# Altium schematic sheet MB252.SchDoc
size A4; Revision: B.1(PCB.SCH)
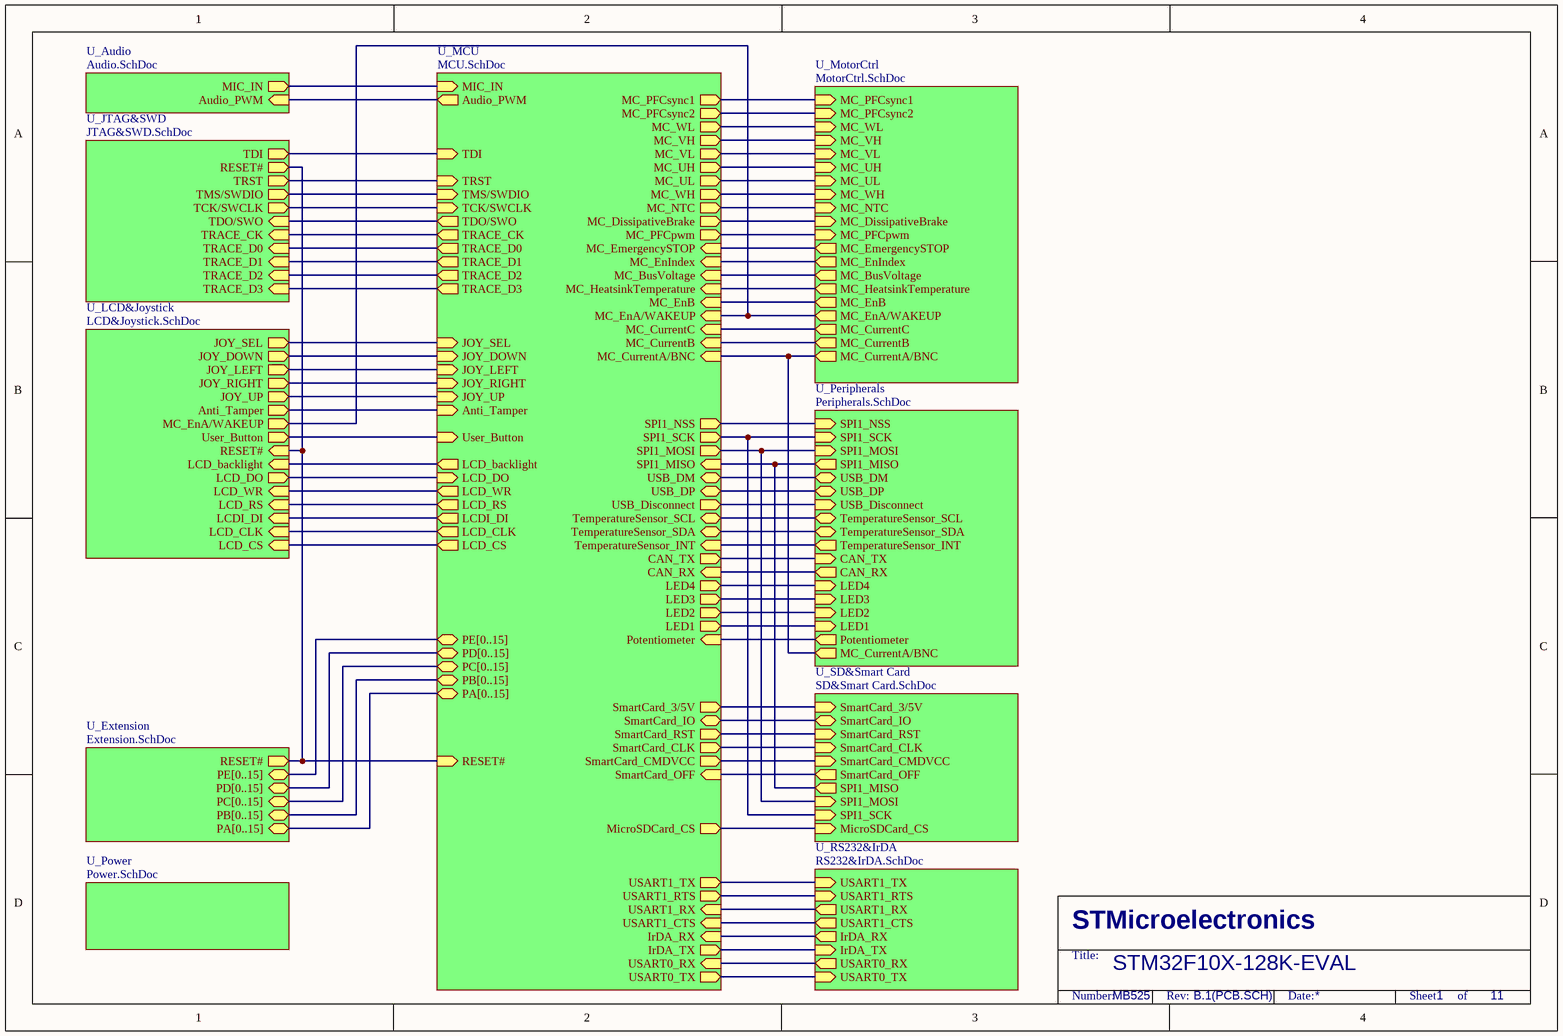
[diagram p0: MB252.SchDoc]

## Sub-sheets
U_Audio = Audio.SchDoc: Audio_PWM (in), MIC_IN (out)
U_Extension = Extension.SchDoc: PA[0..15] (bidir), PB[0..15] (bidir), PC[0..15] (bidir), PD[0..15] (bidir), PE[0..15] (bidir), RESET# (out)
U_JTAG&SWD = JTAG&SWD.SchDoc: TDI (out), RESET# (out), TRACE_D3 (in), TRACE_D2 (in), TRACE_D1 (in), TRACE_D0 (in), TRACE_CK (in), TRST (out), TMS/SWDIO (out), TCK/SWCLK (out), TDO/SWO (in)
U_LCD&Joystick = LCD&Joystick.SchDoc: JOY_SEL (out), JOY_DOWN (out), JOY_LEFT (out), JOY_RIGHT (out), JOY_UP (out), LCD_CS (in), LCD_CLK (in), LCD_DO (out), LCDI_DI (in), LCD_RS (in), LCD_WR (in), RESET# (in), LCD_backlight (in), Anti_Tamper (out), MC_EnA/WAKEUP (out), User_Button (out)
U_MCU = MCU.SchDoc: MC_EnA/WAKEUP (in), MC_EnB (in), JOY_DOWN (in), MC_BusVoltage (in), SPI1_NSS (out), SPI1_SCK (out), SPI1_MISO (in), SPI1_MOSI (out), LCD_backlight (out), USART0_TX (out), USART0_RX (in), USB_DM (bidir), USB_DP (bidir), TMS/SWDIO (in), TCK/SWCLK (in), TDI (in), MC_PFCsync1 (out), MC_PFCpwm (out), TDO/SWO (out), TRST (in), TemperatureSensor_INT (in), TemperatureSensor_SCL (bidir), TemperatureSensor_SDA (bidir), Audio_PWM (out), User_Button (in), SmartCard_IO (bidir), SmartCard_RST (out), SmartCard_CLK (out), LCD_CLK (out), LCD_DO (in), LCDI_DI (out), LCD_CS (out), RESET# (in), LCD_WR (out), MC_EnIndex (in), MC_DissipativeBrake (out), JOY_SEL (in), SmartCard_3/5V (out), MC_NTC (out), USB_Disconnect (out), JOY_UP (in), USART1_RX (in), USART1_TX (out), USART1_RTS (out), USART1_CTS (in), MC_PFCsync2 (out), CAN_TX (out), CAN_RX (in), MC_EmergencySTOP (in), SmartCard_OFF (in), MC_WL (out), MC_VH (out), MC_VL (out), MC_UH (out), MC_UL (out), SmartCard_CMDVCC (out), TRACE_D3 (out), TRACE_D2 (out), TRACE_D1 (out), TRACE_D0 (out), TRACE_CK (out), JOY_LEFT (in), JOY_RIGHT (in), MC_WH (out), LCD_RS (out), Anti_Tamper (in), MicroSDCard_CS (out), IrDA_RX (in), IrDA_TX (out), LED4 (out), LED3 (out), LED1 (out), MIC_IN (in), Potentiometer (in), MC_CurrentC (in), MC_CurrentB (in), MC_CurrentA/BNC (in), MC_HeatsinkTemperature (in), LED2 (out), PA[0..15] (bidir), PB[0..15] (bidir), PC[0..15] (bidir), PD[0..15] (bidir), PE[0..15] (bidir)
U_MotorCtrl = MotorCtrl.SchDoc: MC_EmergencySTOP (out), MC_CurrentA/BNC (out), MC_CurrentB (out), MC_CurrentC (out), MC_PFCsync1 (in), MC_PFCsync2 (in), MC_WL (in), MC_VH (in), MC_VL (in), MC_UH (in), MC_UL (in), MC_WH (in), MC_NTC (in), MC_DissipativeBrake (in), MC_PFCpwm (in), MC_EnA/WAKEUP (out), MC_EnB (out), MC_HeatsinkTemperature (out), MC_BusVoltage (out), MC_EnIndex (out)
U_Peripherals = Peripherals.SchDoc: SPI1_NSS (in), SPI1_SCK (in), SPI1_MISO (out), SPI1_MOSI (in), LED4 (in), LED3 (in), LED1 (in), LED2 (in), USB_DM (bidir), USB_DP (bidir), USB_Disconnect (in), TemperatureSensor_INT (out), TemperatureSensor_SCL (bidir), TemperatureSensor_SDA (bidir), MC_CurrentA/BNC (out), CAN_TX (in), CAN_RX (out), Potentiometer (out)
U_Power = Power.SchDoc: no entries
U_RS232&IrDA = RS232&IrDA.SchDoc: USART1_RX (out), USART1_TX (in), USART1_RTS (in), USART1_CTS (out), USART0_TX (in), USART0_RX (out), IrDA_RX (out), IrDA_TX (in)
U_SD&Smart Card = SD&Smart Card.SchDoc: SmartCard_3/5V (in), SmartCard_IO (bidir), SmartCard_RST (in), SmartCard_CLK (in), SmartCard_OFF (out), SmartCard_CMDVCC (in), SPI1_SCK (in), SPI1_MISO (out), SPI1_MOSI (in), MicroSDCard_CS (in)

## Nets
(unnamed): sheet U_MCU/MC_EnA/WAKEUP, sheet U_LCD&Joystick/MC_EnA/WAKEUP, sheet U_MotorCtrl/MC_EnA/WAKEUP
(unnamed): sheet U_MCU/MC_EnB, sheet U_MotorCtrl/MC_EnB
(unnamed): sheet U_MCU/JOY_DOWN, sheet U_LCD&Joystick/JOY_DOWN
(unnamed): sheet U_MCU/MC_BusVoltage, sheet U_MotorCtrl/MC_BusVoltage
(unnamed): sheet U_MCU/SPI1_NSS, sheet U_Peripherals/SPI1_NSS
(unnamed): sheet U_MCU/SPI1_SCK, sheet U_Peripherals/SPI1_SCK, sheet U_SD&Smart Card/SPI1_SCK
(unnamed): sheet U_MCU/SPI1_MISO, sheet U_Peripherals/SPI1_MISO, sheet U_SD&Smart Card/SPI1_MISO
(unnamed): sheet U_MCU/SPI1_MOSI, sheet U_Peripherals/SPI1_MOSI, sheet U_SD&Smart Card/SPI1_MOSI
(unnamed): sheet U_MCU/LCD_backlight, sheet U_LCD&Joystick/LCD_backlight
(unnamed): sheet U_MCU/USART0_TX, sheet U_RS232&IrDA/USART0_TX
(unnamed): sheet U_MCU/USART0_RX, sheet U_RS232&IrDA/USART0_RX
(unnamed): sheet U_MCU/USB_DM, sheet U_Peripherals/USB_DM
(unnamed): sheet U_MCU/USB_DP, sheet U_Peripherals/USB_DP
(unnamed): sheet U_MCU/TMS/SWDIO, sheet U_JTAG&SWD/TMS/SWDIO
(unnamed): sheet U_MCU/TCK/SWCLK, sheet U_JTAG&SWD/TCK/SWCLK
(unnamed): sheet U_MCU/TDI, sheet U_JTAG&SWD/TDI
(unnamed): sheet U_MCU/MC_PFCsync1, sheet U_MotorCtrl/MC_PFCsync1
(unnamed): sheet U_MCU/MC_PFCpwm, sheet U_MotorCtrl/MC_PFCpwm
(unnamed): sheet U_MCU/TDO/SWO, sheet U_JTAG&SWD/TDO/SWO
(unnamed): sheet U_MCU/TRST, sheet U_JTAG&SWD/TRST
(unnamed): sheet U_MCU/TemperatureSensor_INT, sheet U_Peripherals/TemperatureSensor_INT
(unnamed): sheet U_MCU/TemperatureSensor_SCL, sheet U_Peripherals/TemperatureSensor_SCL
(unnamed): sheet U_MCU/TemperatureSensor_SDA, sheet U_Peripherals/TemperatureSensor_SDA
(unnamed): sheet U_MCU/Audio_PWM, sheet U_Audio/Audio_PWM
(unnamed): sheet U_MCU/User_Button, sheet U_LCD&Joystick/User_Button
(unnamed): sheet U_MCU/SmartCard_IO, sheet U_SD&Smart Card/SmartCard_IO
(unnamed): sheet U_MCU/SmartCard_RST, sheet U_SD&Smart Card/SmartCard_RST
(unnamed): sheet U_MCU/SmartCard_CLK, sheet U_SD&Smart Card/SmartCard_CLK
(unnamed): sheet U_MCU/LCD_CLK, sheet U_LCD&Joystick/LCD_CLK
(unnamed): sheet U_MCU/LCD_DO, sheet U_LCD&Joystick/LCD_DO
(unnamed): sheet U_MCU/LCDI_DI, sheet U_LCD&Joystick/LCDI_DI
(unnamed): sheet U_MCU/LCD_CS, sheet U_LCD&Joystick/LCD_CS
(unnamed): sheet U_MCU/RESET#, sheet U_Extension/RESET#, sheet U_JTAG&SWD/RESET#, sheet U_LCD&Joystick/RESET#
(unnamed): sheet U_MCU/LCD_WR, sheet U_LCD&Joystick/LCD_WR
(unnamed): sheet U_MCU/MC_EnIndex, sheet U_MotorCtrl/MC_EnIndex
(unnamed): sheet U_MCU/MC_DissipativeBrake, sheet U_MotorCtrl/MC_DissipativeBrake
(unnamed): sheet U_MCU/JOY_SEL, sheet U_LCD&Joystick/JOY_SEL
(unnamed): sheet U_MCU/SmartCard_3/5V, sheet U_SD&Smart Card/SmartCard_3/5V
(unnamed): sheet U_MCU/MC_NTC, sheet U_MotorCtrl/MC_NTC
(unnamed): sheet U_MCU/USB_Disconnect, sheet U_Peripherals/USB_Disconnect
(unnamed): sheet U_MCU/JOY_UP, sheet U_LCD&Joystick/JOY_UP
(unnamed): sheet U_MCU/USART1_RX, sheet U_RS232&IrDA/USART1_RX
(unnamed): sheet U_MCU/USART1_TX, sheet U_RS232&IrDA/USART1_TX
(unnamed): sheet U_MCU/USART1_RTS, sheet U_RS232&IrDA/USART1_RTS
(unnamed): sheet U_MCU/USART1_CTS, sheet U_RS232&IrDA/USART1_CTS
(unnamed): sheet U_MCU/MC_PFCsync2, sheet U_MotorCtrl/MC_PFCsync2
(unnamed): sheet U_MCU/CAN_TX, sheet U_Peripherals/CAN_TX
(unnamed): sheet U_MCU/CAN_RX, sheet U_Peripherals/CAN_RX
(unnamed): sheet U_MCU/MC_EmergencySTOP, sheet U_MotorCtrl/MC_EmergencySTOP
(unnamed): sheet U_MCU/SmartCard_OFF, sheet U_SD&Smart Card/SmartCard_OFF
(unnamed): sheet U_MCU/MC_WL, sheet U_MotorCtrl/MC_WL
(unnamed): sheet U_MCU/MC_VH, sheet U_MotorCtrl/MC_VH
(unnamed): sheet U_MCU/MC_VL, sheet U_MotorCtrl/MC_VL
(unnamed): sheet U_MCU/MC_UH, sheet U_MotorCtrl/MC_UH
(unnamed): sheet U_MCU/MC_UL, sheet U_MotorCtrl/MC_UL
(unnamed): sheet U_MCU/SmartCard_CMDVCC, sheet U_SD&Smart Card/SmartCard_CMDVCC
(unnamed): sheet U_MCU/TRACE_D3, sheet U_JTAG&SWD/TRACE_D3
(unnamed): sheet U_MCU/TRACE_D2, sheet U_JTAG&SWD/TRACE_D2
(unnamed): sheet U_MCU/TRACE_D1, sheet U_JTAG&SWD/TRACE_D1
(unnamed): sheet U_MCU/TRACE_D0, sheet U_JTAG&SWD/TRACE_D0
(unnamed): sheet U_MCU/TRACE_CK, sheet U_JTAG&SWD/TRACE_CK
(unnamed): sheet U_MCU/JOY_LEFT, sheet U_LCD&Joystick/JOY_LEFT
(unnamed): sheet U_MCU/JOY_RIGHT, sheet U_LCD&Joystick/JOY_RIGHT
(unnamed): sheet U_MCU/MC_WH, sheet U_MotorCtrl/MC_WH
(unnamed): sheet U_MCU/LCD_RS, sheet U_LCD&Joystick/LCD_RS
(unnamed): sheet U_MCU/Anti_Tamper, sheet U_LCD&Joystick/Anti_Tamper
(unnamed): sheet U_MCU/MicroSDCard_CS, sheet U_SD&Smart Card/MicroSDCard_CS
(unnamed): sheet U_MCU/IrDA_RX, sheet U_RS232&IrDA/IrDA_RX
(unnamed): sheet U_MCU/IrDA_TX, sheet U_RS232&IrDA/IrDA_TX
(unnamed): sheet U_MCU/LED4, sheet U_Peripherals/LED4
(unnamed): sheet U_MCU/LED3, sheet U_Peripherals/LED3
(unnamed): sheet U_MCU/LED1, sheet U_Peripherals/LED1
(unnamed): sheet U_MCU/MIC_IN, sheet U_Audio/MIC_IN
(unnamed): sheet U_MCU/Potentiometer, sheet U_Peripherals/Potentiometer
(unnamed): sheet U_MCU/MC_CurrentC, sheet U_MotorCtrl/MC_CurrentC
(unnamed): sheet U_MCU/MC_CurrentB, sheet U_MotorCtrl/MC_CurrentB
(unnamed): sheet U_MCU/MC_CurrentA/BNC, sheet U_MotorCtrl/MC_CurrentA/BNC, sheet U_Peripherals/MC_CurrentA/BNC
(unnamed): sheet U_MCU/MC_HeatsinkTemperature, sheet U_MotorCtrl/MC_HeatsinkTemperature
(unnamed): sheet U_MCU/LED2, sheet U_Peripherals/LED2

## Buses and harness runs
bus sheet U_Extension/PA[0..15] = sheet U_MCU/PA[0..15]
bus sheet U_Extension/PB[0..15] = sheet U_MCU/PB[0..15]
bus sheet U_Extension/PC[0..15] = sheet U_MCU/PC[0..15]
bus sheet U_Extension/PD[0..15] = sheet U_MCU/PD[0..15]
bus sheet U_Extension/PE[0..15] = sheet U_MCU/PE[0..15]

## Notes on the sheet
- STM32F10X-128K-EVAL
- MB525
- 1
- 11
- STMicroelectronics
- Title:
- Number:
- Rev:
- Date:
- Sheet       of